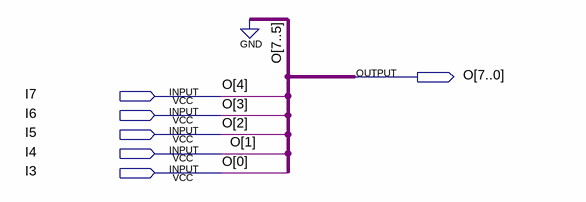
[diagram p0: schematic sheet]
// Quartus schematic SR3.bdf as structural Verilog: 0 symbols, 6 pins
module SR3 (
  input  I7,
  input  I6,
  input  I5,
  input  I4,
  input  I3,
  output [7:0] O
);


  assign O = {3'b000, I7, I6, I5, I4, I3};
endmodule
